# EAGLE schematic Escorna_CPU_2_40 (EAGLE 6.5.0)
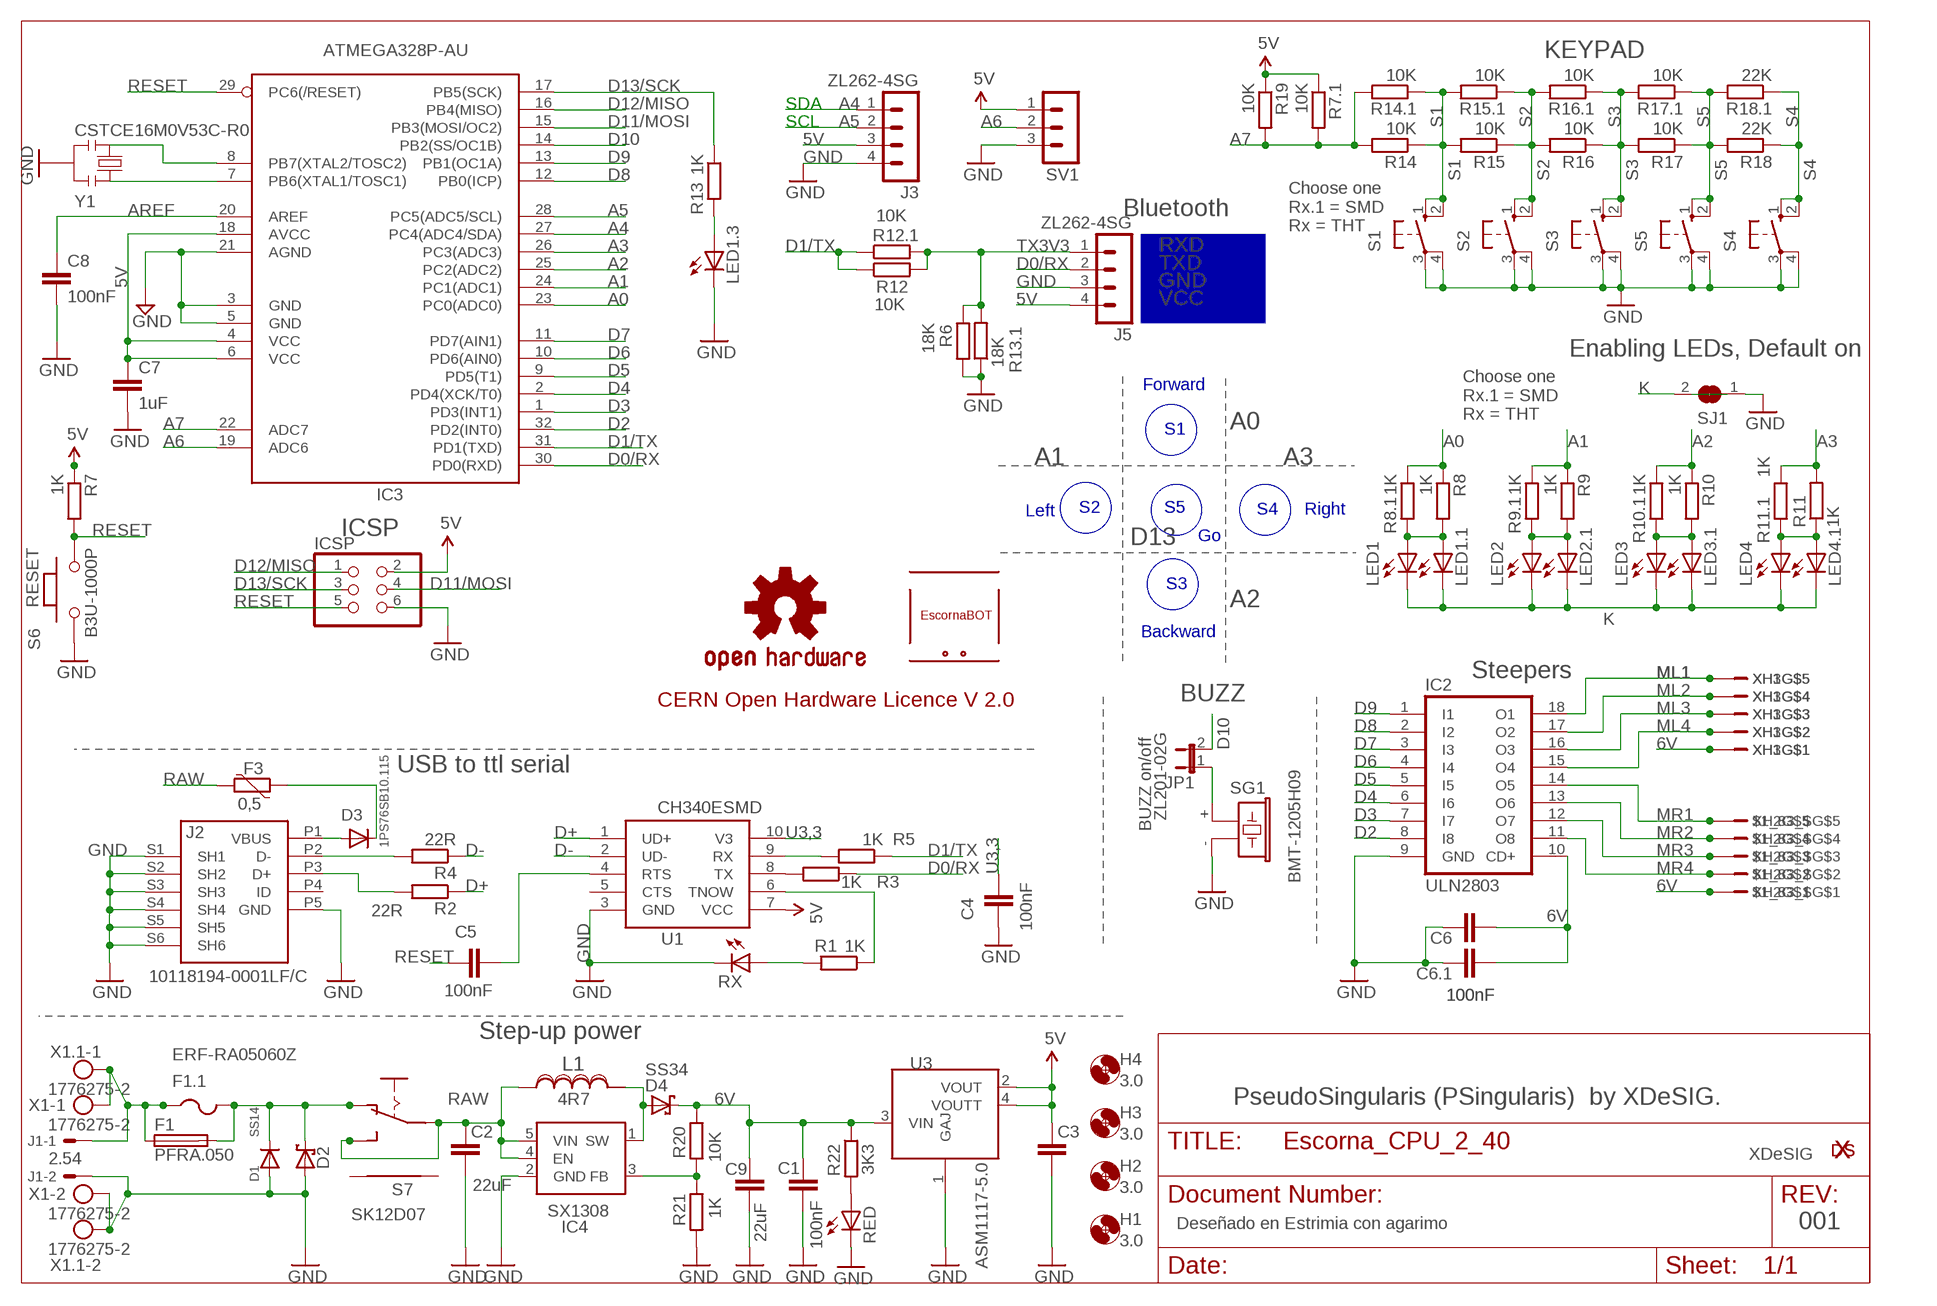
[diagram p0: schematic, sheet 1]

## Parts
$1_82_$  XDESIG_XDESIG21  [XDESIG_XDESIG]
$1_83_$  B5B-XH-A  [B5B-XH-A]
C1  100nF  0015_100NF_0603  [C0603-ROUND]
C2  22uF  C-EUC1206K  [C1206K]
C3  10uF  C-EUC1206K  [C1206K]
C4  100nF  0015_100NF_0603  [C0603-ROUND]
C5  100nF  0015_100NF_0603  [C0603-ROUND]
C6  100nF  C-EU025-024X044  [C025-024X044]
C6.1  100nF  C-EUC0603K  [C0603K]
C7  1uF  0006_1UF_0603/GRM188R61E105KA12D  [C0603-ROUND]
C8  100nF  0015_100NF_0603  [C0603-ROUND]
C9  22uF  C-EUC1206K  [C1206K]
D1  SS14  DIODESMA  [SMADIODE]
D2  1N5817  P4KEXX  [DO41-10]
D3  1PS76SB10.115  DIODESOD-323F  [SOD-323F]
D4  SS34  DIODE_SCHOTTKY-DIODESMA  [DIODE_SMA]
ESC  ESCORNABOT  [ESCORNA_PEQUE]
F1  PFRA.050  FUSETE5  [TE5]
F1.1  ERF-RA05060Z  PTCFUSE-1206  [R1206]
F3  0,5  PTC1206L  [R1206]
H1  3.0  MOUNT-HOLE3.0  [3,0]
H2  3.0  MOUNT-HOLE3.0  [3,0]
H3  3.0  MOUNT-HOLE3.0  [3,0]
H4  3.0  MOUNT-HOLE3.0  [3,0]
IC2  ULN2803  ULN2803A  [DIL18]
IC3  ATMEGA328P-AU  0265_ATMEGA328P-AU  [TQFP32-08]
IC4  SX1308  [SOT23-6]
ICSP  0114_PH254-203DF118A00V  [2X03]
J1  2.54  22-27-2021-02  [6410-02]
J2  10118194-0001LF/C  SMARTPRJ_MYCON2_USB-MINI-B  [SMARTPRJ_CON2_USB_MICRO_B_AT]
J3  ZL262-4SG  MA04-1  [MA04-1]
J5  ZL262-4SG  MA04-1  [MA04-1]
JP1  ZL201-02G  JP1E  [JP1]
L1  4R7  SRN6045-330M6045  [SRN6045]
LED1  LED3MM  [LED3MM]
LED1.1  LEDCHIPLED_0603  [CHIPLED_0603]
LED1.3  LEDCHIPLED_0603  [CHIPLED_0603]
LED2  LED3MM  [LED3MM]
LED2.1  LEDCHIPLED_0603  [CHIPLED_0603]
LED3  LED3MM  [LED3MM]
LED3.1  LEDCHIPLED_0603  [CHIPLED_0603]
LED4  LED3MM  [LED3MM]
LED4.1  LEDCHIPLED_0603  [CHIPLED_0603]
LOGO2  OSHW-LOGOL  [ESCORNA_LBRESCORNA_CPU_2_10_SPARKFUN-AESTHETICS_OSHW-LOGO-L]
R1  1K  R-EU_R0603  [R0603]
R2  22R  R-EU_R0603  [R0603]
R3  1K  R-EU_R0603  [R0603]
R4  22R  R-EU_R0603  [R0603]
R5  1K  R-EU_R0603  [R0603]
R6  18K  R-EU_0204/7  [0204/7]
R7  1K  R-EU_R0603  [R0603]
R7.1  10K  R-EU_R0603  [R0603]
R8  1K  R-EU_0204/7  [0204/7]
R8.1  1K  R-EU_R0603  [R0603]
R9  1K  R-EU_0204/7  [0204/7]
R9.1  1K  R-EU_R0603  [R0603]
R10  1K  R-EU_0204/7  [0204/7]
R10.1  1K  R-EU_R0603  [R0603]
R11  1K  R-EU_0204/7  [0204/7]
R11.1  1K  R-EU_R0603  [R0603]
R12  10K  R-EU_0204/7  [0204/7]
R12.1  10K  R-EU_R0603  [R0603]
R13  1K  R-EU_R0603  [R0603]
R13.1  18K  R-EU_R0603  [R0603]
R14  10K  R-EU_0204/7  [0204/7]
R14.1  10K  R-EU_R0603  [R0603]
R15  10K  R-EU_0204/7  [0204/7]
R15.1  10K  R-EU_R0603  [R0603]
R16  10K  R-EU_0204/7  [0204/7]
R16.1  10K  R-EU_R0603  [R0603]
R17  10K  R-EU_0204/7  [0204/7]
R17.1  10K  R-EU_R0603  [R0603]
R18  22K  R-EU_0204/7  [0204/7]
R18.1  22K  R-EU_R0603  [R0603]
R19  10K  R-EU_0204/7  [0204/7]
R20  10K  R-EU_R0603  [R0603]
R21  1K  R-EU_R0603  [R0603]
R22  3K3  R-EU_R0603  [R0603]
RED  LEDCHIPLED_0603  [CHIPLED_0603]
RX  LEDCHIPLED_0603  [CHIPLED_0603]
S1  40-XX  [B3F-40]
S2  40-XX  [B3F-40]
S3  40-XX  [B3F-40]
S4  40-XX  [B3F-40]
S5  40-XX  [B3F-40]
S6  B3U-1000P  0173_IT-1185AP1C-160G-G_T&R  [SMD_157SW]
S7  SK12D07  ESCORNA_SK12F14D  [ESCORNA_SK-12D07]
SG1  BMT-1205H09  F/CM12P  [F/CM12P]
SJ1  SJ  [SJ]
SV1  MA03-1  [MA03-1]
U1  CH340ESMD  [MSOP10]
U3  ASM1117-5.0  ASM1117-3.3  [SOT223]
X1  1776275-2  AK550/2  [AK550/2]
X1.1  1776275-2  AK550/2  [AK550/2]
XDS2  XDESIG  [XDESIG_CU_2]
XH1  B5B-XH-A  [B5B-XH-A]
XH2  B5B-XH-A  [B5B-XH-A]
XH3  B5B-XH-A  [B5B-XH-A]
Y1  CSTCE16M0V53C-R0  0011_CSTCE16M0V53-R0  [RESONATOR]

## Nets
5V: C3.2 C7.1 IC3.4(VCC) IC3.6(VCC) IC3.18(AVCC) ICSP.2 J3.3 J5.4 R7.1 R7.1.1 R19.1 SV1.1 U1.7(VCC) U3.2(VOUT) U3.4(VOUTT)
6V: $1_83_$.P$1 C1.2 C6.1.2 C6.2 C9.2 D4.C IC2.10(CD+) R20.1 R22.1 U3.3(VIN) XH1.P$1 XH2.P$1 XH3.P$1
A0: IC3.23(PC0(ADC0)) R8.1 R8.1.1
A1: IC3.24(PC1(ADC1)) R9.1 R9.1.1
A2: IC3.25(PC2(ADC2)) R10.1 R10.1.1
A3: IC3.26(PC3(ADC3)) R11.1.1 R11.2
A4: IC3.27(PC4(ADC4/SDA)) J3.1
A5: IC3.28(PC5(ADC5/SCL)) J3.2
A6: IC3.19(ADC6) SV1.2
A7: IC3.22(ADC7) R7.1.2 R14.1.2 R14.2 R19.2
AREF [aref]: C8.1 IC3.20(AREF)
D0/RX: IC3.30(PD0(RXD)) J5.2 R3.1
D1/TX: IC3.31(PD1(TXD)) R5.1 R12.1 R12.1.1
D2: IC2.8(I8) IC3.32(PD2(INT0))
D3: IC2.7(I7) IC3.1(PD3(INT1))
D4: IC2.6(I6) IC3.2(PD4(XCK/T0))
D5: IC2.5(I5) IC3.9(PD5(T1))
D6: IC2.4(I4) IC3.10(PD6(AIN0))
D7: IC2.3(I3) IC3.11(PD7(AIN1))
D8: IC2.2(I2) IC3.12(PB0(ICP))
D9: IC2.1(I1) IC3.13(PB1(OC1A))
D10: IC3.14(PB2(SS/OC1B)) JP1.2
D11/MOSI: IC3.15(PB3(MOSI/OC2)) ICSP.4
D12/MISO: IC3.16(PB4(MISO)) ICSP.1
D13/SCK: IC3.17(PB5(SCK)) ICSP.3 R13.1
D+: R2.1 U1.1(UD+)
D-: R4.1 U1.2(UD-)
DTR?: C5.2 U1.4(RTS)
GND: C1.1 C2.1 C3.1 C4.1 C6.1 C6.1.1 C7.2 C8.2 C9.1 D1.A D2.A IC2.9(GND) IC3.3(GND) IC3.5(GND) IC3.21(AGND) IC4.2(GND) ICSP.6 J1.2 J2.P5(GND) J2.S1(SH1) J2.S2(SH2) J2.S3(SH3) J2.S4(SH4) J2.S5(SH5) J2.S6(SH6) J3.4 J5.3 LED1.3.C R6.2 R13.1.1 R21.2 RED.C RX.C S1.3(P) S1.4(P1) S2.3(P) S2.4(P1) S3.3(P) S3.4(P1) S4.3(P) S4.4(P1) S5.3(P) S5.4(P1) S6.1 SG1.- SJ1.1 SV1.3 U1.3(GND) U3.1(GAJ) X1.1.2 X1.2 Y1.2
K: LED1.1.C LED1.K(C) LED2.1.C LED2.K(C) LED3.1.C LED3.K(C) LED4.1.C LED4.K(C) SJ1.2
ML1: IC2.18(O1) XH1.P$5 XH3.P$5
ML2: IC2.17(O2) XH1.P$4 XH3.P$4
ML3: IC2.16(O3) XH1.P$3 XH3.P$3
ML4: IC2.15(O4) XH1.P$2 XH3.P$2
MR1: $1_83_$.P$5 IC2.14(O5) XH2.P$5
MR2: $1_83_$.P$4 IC2.13(O6) XH2.P$4
MR3: $1_83_$.P$3 IC2.12(O7) XH2.P$3
MR4: $1_83_$.P$2 IC2.11(O8) XH2.P$2
N$2: JP1.1 SG1.+
N$3: D1.C D2.C F1.1.2 F1.2 S7.P$2(O)
N$4: LED2.1.A LED2.A R9.1.2 R9.2
N$5: LED1.1.A LED1.A R8.1.2 R8.2
N$6: LED3.1.A LED3.A R10.1.2 R10.2
N$8: LED4.1.A LED4.A R11.1 R11.1.2
N$10: D3.A J2.P1(VBUS)
N$11: J2.P2(D-) R4.2
N$12: F1.1 F1.1.1 J1.1 X1.1 X1.1.1
N$14: J2.P3(D+) R2.2
N$15: R1.2 RX.A
N$16: IC4.3(FB) R20.2 R21.1
N$17: IC3.7(PB6(XTAL1/TOSC1)) Y1.1
N$18: IC3.8(PB7(XTAL2/TOSC2)) Y1.3
N$19: LED1.3.A R13.2
N$20: D4.A IC4.1(SW) L1.1
N$21: D3.C F3.1
N$22: R22.2 RED.A
N$23: R5.2 U1.9(RX)
N$24: R3.2 U1.8(TX)
N$25: R1.1 U1.6(TNOW)
RAW: C2.2 F3.2 IC4.4(EN) IC4.5(VIN) L1.2 S7.P$1(P) S7.P$3(S)
RESET: C5.1 IC3.29(PC6(/RESET)) ICSP.5 R7.2 S6.2
S1: R14.1 R14.1.1 R15.1.2 R15.2 S1.1(S) S1.2(S1)
S2: R15.1 R15.1.1 R16.1.2 R16.2 S2.1(S) S2.2(S1)
S3: R16.1 R16.1.1 R17.1.2 R17.2 S3.1(S) S3.2(S1)
S4: R18.1 R18.1.1 S4.1(S) S4.2(S1)
S5: R17.1 R17.1.1 R18.1.2 R18.2 S5.1(S) S5.2(S1)
TX3V3: J5.1 R6.1 R12.1.2 R12.2 R13.1.2
U3,3: C4.2 U1.10(V3)
Unconnected: J2.P4(ID) S7.P$4 S7.P$5 U1.5(CTS)

## Notes on the sheet
- KEYPAD
- SDA
- SCL
- Bluetooth
- Choose one
  Rx.1 = SMD
  Rx = THT
- RXD
- TXD
- GND
- VCC
- Enabling LEDs, Default on
- Forward
- A0
- S1
- Choose one
  Rx.1 = SMD
  Rx = THT
- A1 | A3
- Left | S2 | S5 | S4 | Right
- ICSP
- D13 | Go
- S3
- RESET | A2
- Backward
- BUZZ | Steepers
- CERN Open Hardware Licence V 2.0
- BUZZ on/off
- USB to ttl serial
- Step-up power
- PseudoSingularis (PSingularis)  by XDeSIG.
- XDeSIG
- SX1308
- IC4 | Deseñado en Estrimia con agarimo | 001

## Library data of the parts
$1_82_$ = Escorna_CPU_2_01:XDESIG_XDESIG
$1_83_$ XH1-XH3 = con-jst:B5B-XH-A
C1 C4 C5 C8 = Condensatori:0015_100NF_0603: 100nF 0603 50V; CASE: 0603; MONTHLY_USAGE: _____; PART_NUMBER: cl10b104kbnc; PRICE: _____; SUPPLIER: _____; TYPE: Condensatori
C2 C3 C6 C6.1 C9 = rcl:C-EU: CAPACITOR, European symbol
C7 = Condensatori:0006_1UF_0603/GRM188R61E105KA12D: 1uF 0603; CASE: 0603; MONTHLY_USAGE: _____; PART_NUMBER: 1uF_0603/GRM188R61E105KA12D; PRICE: _____; SUPPLIER: _____; TYPE: Condensatori
D1 D3 = adafruit:DIODE: Diode SMADIODE - SMA Surface Mount Package 20V 1A Schottky Diode Digikey: 641-1014-6-ND DO-1N4148 - Through Hole Small Current Diode SOD-123 20V 1 A (.5mV Vf) Schottky Diode - Digikey: MBRX120TPMSCT-ND SOD-323 10V 570mA (.38mV Vf, 3ns) Schottky Diode - Digikey: ZLLS410CT-ND SOD-523 30V 30mA Schottky Diode (RB751S-40TE61) - Digikey: RB751S-40TE61CT-ND SOT23-R/W - SOT23 Package (R = Solder Paste/Reflow Ovens, W = Hand-Soldering) BAT54Film 40V 300mA - Digikey: 497-7162-1-ND
D2 = diode:P4KEXX: DIODE transient-voltage suppressor
D4 = cervus2.100:DIODE_SCHOTTKY-DIODE: Schottky Diode
ESC = escorna:ESCORNABOT
F1 = fuse:FUSE: Fuse; OC_FARNELL: unknown; OC_NEWARK: unknown
F1.1 = adafruit:PTCFUSE: PTC fuses, resettable thermistors
F3 = Arduino-rcl:PTC: SMD PTC
H1-H4 = holes:MOUNT-HOLE: MOUNTING HOLE with drill center marker
IC2 = uln-udn:ULN2803A: DRIVER ARRAY
IC3 = IntegratedCircuits:0265_ATMEGA328P-AU: 8-bit Microcontroller with 32KBytes In-System Programmable Flash ATMEGA328P-AU; CASE: TQFP32_7x7; MONTHLY_USAGE: _____; PART_NUMBER: ATMEGA328P-AU; PRICE: _____; SUPPLIER: _____; TYPE: Circuito_Integrato
IC4 = SX1308:SX1308
ICSP = Connettori:0114_PH254-203DF118A00V: 3x2 M V h 8,5 mm p2,54; MONTHLY_USAGE: _____; PART_NUMBER: PH254-203DF118A00V; PRICE: _____; SUPPLIER: _____; TYPE: Connettori; VALUE: ICSP
J1 = con-molex:22-?-02: CONNECTOR wire to board 2.54 mm (.1 inch) pitch header; OC_FARNELL: unknown; OC_NEWARK: unknown
J2 = cervus2.100:SMARTPRJ_MYCON2_USB-MINI-B
J3 J5 = con-lstb:MA04-1: PIN HEADER; OC_FARNELL: unknown; OC_NEWARK: unknown
JP1 = jumper:JP1E: JUMPER
L1 = SRN6045-330M:SRN6045-330M: Fixed Inductors SMD; AVAILABILITY: Unavailable; DESCRIPTION: 33µH Semi-Shielded Wirewound Inductor 1.4A 188mOhm Max Nonstandard; MF: Bourns; MP: SRN6045-330M; PACKAGE: Nonstandard Bourns; PRICE: None
LED1 LED1.1 LED1.3 LED2 LED2.1 LED3 LED3.1 LED4 LED4.1 RED RX = adafruit:LED: LED OSRAM: - CHIPLED LG R971, LG N971, LY N971, LG Q971, LY Q971, LO R971, LY R971 LH N974, LH R974 LS Q976, LO Q976, LY Q976 LO Q996 - Hyper CHIPLED LW Q18S LB Q993, LB Q99A, LB R99A - SideLED LS A670, LO A670, LY A670, LG A670, LP A670 LB A673, LV A673, LT A673, LW A673 LH A674 LY A675 LS A676, LA A676, LO A676, LY A676, LW A676 LS A679, LY A679, LG A679 - Hyper Micro SIDELED® LS Y876, LA Y876, LO Y876, LY Y876 LT Y87S - SmartLED LW L88C, LW L88S LB L89C, LB L89S, LG L890 LS L89K, LO L89K, LY L89K LS L896, LA L896, LO L896, LY L896 - TOPLED LS T670, LO T670, LY T670, LG T670, LP T670 LSG T670, LSP T670, LSY T670, LOP T670, LYG T670 LG T671, LOG T671, LSG T671 LB T673, LV T673, LT T673, LW T673 LH T674 LS T676, LA T676, LO T676, LY T676, LB T676, LH T676, LSB T676, LW T676 LB T67C, LV T67C, LT T67C, LS T67K, LO T67K, LY T67K, LW E67C LS E67B, LA E67B, LO E67B, LY E67B, LB E67C, LV E67C, LT E67C LW T67C LS T679, LY T679, LG T679 LS T770, LO T770, LY T770, LG T770, LP T770 LB T773, LV T773, LT T773, LW T773 LH T774 LS E675, LA E675, LY E675, LS T675 LS T776, LA T776, LO T776, LY T776, LB T776 LHGB T686 LT T68C, LB T68C - Hyper Mini TOPLED® LB M676 - Mini TOPLED Santana® LG M470 LS M47K, LO M47K, LY M47K Source: http://www.osram.convergy.de/
LOGO2 = Echidna_shield_LBR:OSHW-LOGO: Open Source Hardware Logo This logo indicates the piece of hardware it is found on incorporates a OSHW license and/or adheres to the definition of open source hardware found here: http://freedomdefined.org/OSHW
R1-R7 R7.1 R8 R8.1 R9 R9.1 R10 R10.1 R11 R11.1 R12 R12.1 R13 R13.1 R14 R14.1 R15 R15.1 R16 R16.1 R17 R17.1 R18 R18.1 R19-R22 = rcl:R-EU_: RESISTOR, European symbol
S1-S5 = switch-omron:40-XX: OMRON SWITCH; MF: OMRON COMPONENTS USA; MPN: B3F-4000; OC_FARNELL: 176434; OC_NEWARK: 36K3105
S6 = Switches:0173_IT-1185AP1C-160G-G_T&R: Pushbutton 4x3 SMD H2,5mm; MONTHLY_USAGE: _____; PART_NUMBER: IT-1185AP1C-160G-G_T&R; PRICE: _____; SUPPLIER: _____; TYPE: Switches; VALUE: 157SW
S7 = escorna_ELIB:ESCORNA_SK12F14
SG1 = buzzer:F/CM12P: BUZZER Source: Buerklin; OC_FARNELL: unknown; OC_NEWARK: unknown
SJ1 = jumper:SJ: SMD solder JUMPER
SV1 = con-lstb:MA03-1: PIN HEADER; OC_FARNELL: unknown; OC_NEWARK: unknown
U1 = CH340E:CH340E: WCH.CN/CH340E See DataSheet： wch.cn <http://www.wch.cn/downloads/CH340DS1_PDF.html>; AVAILABILITY: Unavailable; DESCRIPTION: USB to serial chip CH340; MF: WCH; MP: CH340E; PACKAGE: Package Analog Devices; PRICE: None
U3 = Itead_IC_110429:ASM1117-3.3: ICP006
X1 X1.1 = con-ptr500:AK550/2: CONNECTOR; OC_FARNELL: unknown; OC_NEWARK: unknown
XDS2 = xdesig:XDESIG
Y1 = Cristalli:0011_CSTCE16M0V53-R0: 16Mhz - SMD; MONTHLY_USAGE: _____; PART_NUMBER: CSTCE16M0V53-R0; PRICE: _____; SUPPLIER: _____; TYPE: Cristalli; VALUE: CSTCE16M0V53-R0

## Net classes
0 default: width 0.254 mm, drill 0.61 mm, clearance 0.254 mm
1 power: width 0.254 mm, drill 0.61 mm, clearance 0.254 mm
4 aref: width 0.254 mm, drill 0.61 mm, clearance 0.254 mm